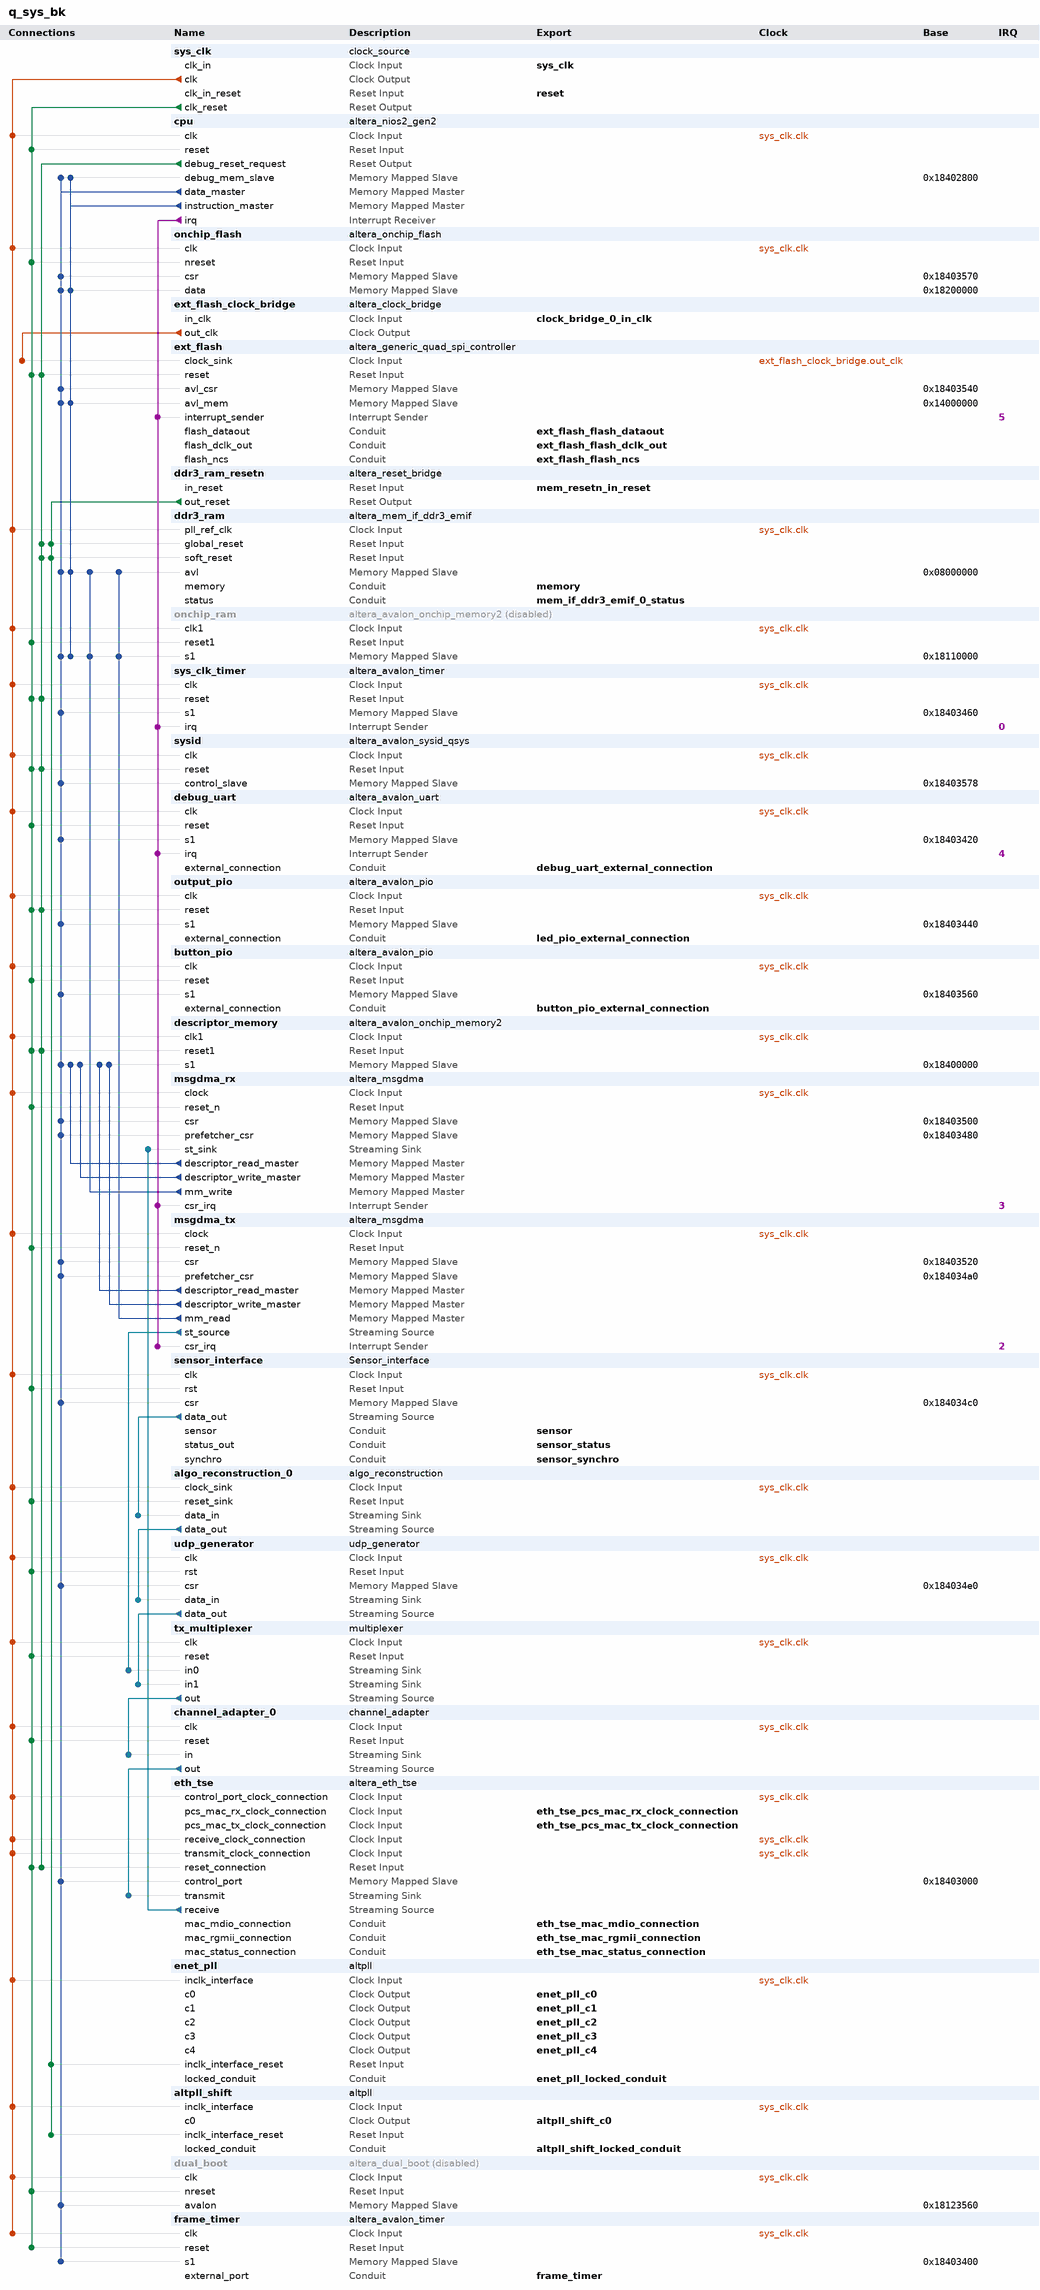
[diagram p0: system contents]
# Platform Designer (Qsys) system q_sys_bk, MAX 10 10M50DAF484C6GES
# Parameters at their usual value, and those the tool derives, are not listed.
package require -exact qsys 19.1
create_system q_sys_bk
set_project_property DEVICE_FAMILY {MAX 10}
set_project_property DEVICE 10M50DAF484C6GES

add_instance sys_clk clock_source 19.1
set_instance_parameter_value sys_clk clockFrequency 50000000

add_instance cpu altera_nios2_gen2 19.1
set_instance_parameter_value cpu dcache_size 2048
set_instance_parameter_value cpu debug_hwbreakpoint 2
set_instance_parameter_value cpu exceptionOffset 288
set_instance_parameter_value cpu exceptionSlave ddr3_ram.avl
set_instance_parameter_value cpu icache_size 2048
set_instance_parameter_value cpu impl Fast
set_instance_parameter_value cpu mul_32_impl 3
set_instance_parameter_value cpu resetSlave ext_flash.avl_mem
set_instance_parameter_value cpu setting_activateTrace true
set_instance_parameter_value cpu shift_rot_impl 0

add_instance onchip_flash altera_onchip_flash 19.1
set_instance_parameter_value onchip_flash CLOCK_FREQUENCY 50.0
set_instance_parameter_value onchip_flash CONFIGURATION_MODE {Single Uncompressed Image with Memory Initialization}
set_instance_parameter_value onchip_flash SECTOR_ACCESS_MODE {Read and write,Read and write,Read and write,Read and write,Read and write}
set_instance_parameter_value onchip_flash initFlashContent false
set_instance_parameter_value onchip_flash initializationFileName D:/projekty/HIT/v2.0/fpga/software/hit20_v3/mem_init/q_sys_onchip_flash.hex
set_instance_parameter_value onchip_flash useNonDefaultInitFile false

add_instance ext_flash_clock_bridge altera_clock_bridge 19.1
set_instance_parameter_value ext_flash_clock_bridge DERIVED_CLOCK_RATE 0
set_instance_parameter_value ext_flash_clock_bridge EXPLICIT_CLOCK_RATE 0

add_instance ext_flash altera_generic_quad_spi_controller 19.1
set_instance_parameter_value ext_flash CHIP_SELS 1
set_instance_parameter_value ext_flash FLASH_TYPE Micron512
set_instance_parameter_value ext_flash IO_MODE QUAD
set_instance_parameter_value ext_flash UNIQUE_ID {$${FILENAME}_ext_flash}
set_instance_parameter_value ext_flash clkFreq 0

add_instance ddr3_ram_resetn altera_reset_bridge 19.1
set_instance_parameter_value ddr3_ram_resetn ACTIVE_LOW_RESET 1
set_instance_parameter_value ddr3_ram_resetn SYNCHRONOUS_EDGES none

add_instance ddr3_ram altera_mem_if_ddr3_emif 19.1
set_instance_parameter_value ddr3_ram AVL_MAX_SIZE 4
set_instance_parameter_value ddr3_ram CALIBRATION_MODE Skip
set_instance_parameter_value ddr3_ram CPORT_TYPE_PORT Bidirectional,Bidirectional,Bidirectional,Bidirectional,Bidirectional,Bidirectional
set_instance_parameter_value ddr3_ram EXPORT_AFI_HALF_CLK false
set_instance_parameter_value ddr3_ram HARD_EMIF false
set_instance_parameter_value ddr3_ram MEM_BANKADDR_WIDTH 3
set_instance_parameter_value ddr3_ram MEM_CLK_FREQ 300.0
set_instance_parameter_value ddr3_ram MEM_CLK_FREQ_MAX 800.0
set_instance_parameter_value ddr3_ram MEM_COL_ADDR_WIDTH 10
set_instance_parameter_value ddr3_ram MEM_DQ_WIDTH 8
set_instance_parameter_value ddr3_ram MEM_DRV_STR RZQ/6
set_instance_parameter_value ddr3_ram MEM_FORMAT DISCRETE
set_instance_parameter_value ddr3_ram MEM_ROW_ADDR_WIDTH 14
set_instance_parameter_value ddr3_ram MEM_RTT_NOM {ODT Disabled}
set_instance_parameter_value ddr3_ram MEM_RTT_WR {Dynamic ODT off}
set_instance_parameter_value ddr3_ram MEM_TCL 5
set_instance_parameter_value ddr3_ram MEM_TFAW_NS 30.0
set_instance_parameter_value ddr3_ram MEM_TRAS_NS 35.0
set_instance_parameter_value ddr3_ram MEM_TRCD_NS 13.75
set_instance_parameter_value ddr3_ram MEM_TRFC_NS 110.0
set_instance_parameter_value ddr3_ram MEM_TRP_NS 13.75
set_instance_parameter_value ddr3_ram MEM_TRRD_NS 6.0
set_instance_parameter_value ddr3_ram MEM_TRTP_NS 7.5
set_instance_parameter_value ddr3_ram MEM_TWTR 6
set_instance_parameter_value ddr3_ram MEM_VENDOR JEDEC
set_instance_parameter_value ddr3_ram MEM_WTCL 5
set_instance_parameter_value ddr3_ram PLL_LOCATION Top_Bottom
set_instance_parameter_value ddr3_ram POWER_OF_TWO_BUS false
set_instance_parameter_value ddr3_ram PRIORITY_PORT 1,1,1,1,1,1
set_instance_parameter_value ddr3_ram RATE Half
set_instance_parameter_value ddr3_ram REF_CLK_FREQ 50.0
set_instance_parameter_value ddr3_ram SPEED_GRADE 6
set_instance_parameter_value ddr3_ram TIMING_BOARD_AC_SKEW 0.07801
set_instance_parameter_value ddr3_ram TIMING_BOARD_AC_TO_CK_SKEW -0.04709
set_instance_parameter_value ddr3_ram TIMING_BOARD_DQ_TO_DQS_SKEW -0.01152
set_instance_parameter_value ddr3_ram TIMING_BOARD_MAX_CK_DELAY 0.2443
set_instance_parameter_value ddr3_ram TIMING_BOARD_MAX_DQS_DELAY 0.21929
set_instance_parameter_value ddr3_ram TIMING_BOARD_SKEW_BETWEEN_DQS 0.04246
set_instance_parameter_value ddr3_ram TIMING_BOARD_SKEW_CKDQS_DIMM_MAX 0.04429
set_instance_parameter_value ddr3_ram TIMING_BOARD_SKEW_CKDQS_DIMM_MIN 0.02286
set_instance_parameter_value ddr3_ram TIMING_BOARD_SKEW_WITHIN_DQS 0.01806
set_instance_parameter_value ddr3_ram TIMING_TDH 45
set_instance_parameter_value ddr3_ram TIMING_TDQSCK 225
set_instance_parameter_value ddr3_ram TIMING_TDQSQ 100
set_instance_parameter_value ddr3_ram TIMING_TDQSS 0.27
set_instance_parameter_value ddr3_ram TIMING_TDS 10
set_instance_parameter_value ddr3_ram TIMING_TDSH 0.18
set_instance_parameter_value ddr3_ram TIMING_TDSS 0.18
set_instance_parameter_value ddr3_ram TIMING_TIH 120
set_instance_parameter_value ddr3_ram TIMING_TIS 170
set_instance_parameter_value ddr3_ram TIMING_TQSH 0.4
set_instance_parameter_value ddr3_ram USER_DEBUG_LEVEL 1

add_instance onchip_ram altera_avalon_onchip_memory2 19.1
set_instance_property onchip_ram ENABLED false
set_instance_parameter_value onchip_ram dataWidth 32
set_instance_parameter_value onchip_ram dualPort false
set_instance_parameter_value onchip_ram initMemContent false
set_instance_parameter_value onchip_ram initializationFileName onchip_mem.hex
set_instance_parameter_value onchip_ram memorySize 65536

add_instance sys_clk_timer altera_avalon_timer 19.1
set_instance_parameter_value sys_clk_timer period 10
set_instance_parameter_value sys_clk_timer periodUnits MSEC

add_instance sysid altera_avalon_sysid_qsys 19.1
set_instance_parameter_value sysid id -87110914

add_instance debug_uart altera_avalon_uart 19.1
set_instance_parameter_value debug_uart baud 115200
set_instance_parameter_value debug_uart dataBits 8
set_instance_parameter_value debug_uart fixedBaud true
set_instance_parameter_value debug_uart parity NONE
set_instance_parameter_value debug_uart stopBits 1

add_instance output_pio altera_avalon_pio 19.1
set_instance_parameter_value output_pio bitModifyingOutReg true
set_instance_parameter_value output_pio direction Output
set_instance_parameter_value output_pio width 8

add_instance button_pio altera_avalon_pio 19.1
set_instance_parameter_value button_pio direction Input
set_instance_parameter_value button_pio width 9

add_instance descriptor_memory altera_avalon_onchip_memory2 19.1
set_instance_parameter_value descriptor_memory dataWidth 32
set_instance_parameter_value descriptor_memory dualPort false
set_instance_parameter_value descriptor_memory initMemContent false
set_instance_parameter_value descriptor_memory initializationFileName /data/acastill/simple_socket_10M50/software/niosII_simple_socket_server/mem_init/q_sys_descriptor_memory.hex
set_instance_parameter_value descriptor_memory memorySize 8192

add_instance msgdma_rx altera_msgdma 19.1
set_instance_parameter_value msgdma_rx BURST_ENABLE 0
set_instance_parameter_value msgdma_rx DATA_FIFO_DEPTH 32
set_instance_parameter_value msgdma_rx DATA_WIDTH 32
set_instance_parameter_value msgdma_rx DESCRIPTOR_FIFO_DEPTH 8
set_instance_parameter_value msgdma_rx ENHANCED_FEATURES 0
set_instance_parameter_value msgdma_rx ERROR_ENABLE 1
set_instance_parameter_value msgdma_rx ERROR_WIDTH 6
set_instance_parameter_value msgdma_rx MAX_BURST_COUNT 2
set_instance_parameter_value msgdma_rx MAX_BYTE 2048
set_instance_parameter_value msgdma_rx MODE 2
set_instance_parameter_value msgdma_rx PACKET_ENABLE 1
set_instance_parameter_value msgdma_rx PREFETCHER_ENABLE 1
set_instance_parameter_value msgdma_rx TRANSFER_TYPE {Aligned Accesses}

add_instance msgdma_tx altera_msgdma 19.1
set_instance_parameter_value msgdma_tx BURST_ENABLE 0
set_instance_parameter_value msgdma_tx DATA_FIFO_DEPTH 32
set_instance_parameter_value msgdma_tx DATA_WIDTH 32
set_instance_parameter_value msgdma_tx DESCRIPTOR_FIFO_DEPTH 8
set_instance_parameter_value msgdma_tx ENHANCED_FEATURES 0
set_instance_parameter_value msgdma_tx ERROR_ENABLE 1
set_instance_parameter_value msgdma_tx ERROR_WIDTH 1
set_instance_parameter_value msgdma_tx MAX_BURST_COUNT 2
set_instance_parameter_value msgdma_tx MAX_BYTE 2048
set_instance_parameter_value msgdma_tx MODE 1
set_instance_parameter_value msgdma_tx PACKET_ENABLE 1
set_instance_parameter_value msgdma_tx PREFETCHER_ENABLE 1
set_instance_parameter_value msgdma_tx TRANSFER_TYPE {Aligned Accesses}

add_instance sensor_interface Sensor_interface 1.1

add_instance algo_reconstruction_0 algo_reconstruction 0

add_instance udp_generator udp_generator 1.0

add_instance tx_multiplexer multiplexer 19.1
set_instance_parameter_value tx_multiplexer bitsPerSymbol 8
set_instance_parameter_value tx_multiplexer errorWidth 1
set_instance_parameter_value tx_multiplexer numInputInterfaces 2
set_instance_parameter_value tx_multiplexer outChannelWidth 1
set_instance_parameter_value tx_multiplexer packetScheduling true
set_instance_parameter_value tx_multiplexer schedulingSize 512
set_instance_parameter_value tx_multiplexer symbolsPerBeat 4
set_instance_parameter_value tx_multiplexer useHighBitsOfChannel true
set_instance_parameter_value tx_multiplexer usePackets true

add_instance channel_adapter_0 channel_adapter 19.1
set_instance_parameter_value channel_adapter_0 inBitsPerSymbol 8
set_instance_parameter_value channel_adapter_0 inChannelWidth 1
set_instance_parameter_value channel_adapter_0 inErrorWidth 1
set_instance_parameter_value channel_adapter_0 inMaxChannel 1
set_instance_parameter_value channel_adapter_0 inReadyLatency 0
set_instance_parameter_value channel_adapter_0 inSymbolsPerBeat 4
set_instance_parameter_value channel_adapter_0 inUseEmpty false
set_instance_parameter_value channel_adapter_0 inUseEmptyPort YES
set_instance_parameter_value channel_adapter_0 inUsePackets true
set_instance_parameter_value channel_adapter_0 inUseReady true
set_instance_parameter_value channel_adapter_0 outChannelWidth 0
set_instance_parameter_value channel_adapter_0 outMaxChannel 1

add_instance eth_tse altera_eth_tse 19.1
set_instance_parameter_value eth_tse XCVR_RCFG_JTAG_ENABLE 0
set_instance_parameter_value eth_tse XCVR_SET_CAPABILITY_REG_ENABLE 0
set_instance_parameter_value eth_tse XCVR_SET_CSR_SOFT_LOGIC_ENABLE 0
set_instance_parameter_value eth_tse XCVR_SET_PRBS_SOFT_LOGIC_ENABLE 0
set_instance_parameter_value eth_tse XCVR_SET_USER_IDENTIFIER 0
set_instance_parameter_value eth_tse core_variation MAC_ONLY
set_instance_parameter_value eth_tse enable_gmii_loopback true
set_instance_parameter_value eth_tse enable_hd_logic true
set_instance_parameter_value eth_tse enable_mac_flow_ctrl false
set_instance_parameter_value eth_tse enable_magic_detect true
set_instance_parameter_value eth_tse enable_sgmii true
set_instance_parameter_value eth_tse enable_shift16 true
set_instance_parameter_value eth_tse ifGMII RGMII
set_instance_parameter_value eth_tse ing_addr 11
set_instance_parameter_value eth_tse mdio_clk_div 40
set_instance_parameter_value eth_tse nf_phyip_rcfg_enable true
set_instance_parameter_value eth_tse stat_cnt_ena true
set_instance_parameter_value eth_tse transceiver_type NONE

add_instance enet_pll altpll 19.1
set_instance_parameter_value enet_pll CLK0_DIVIDE_BY 2
set_instance_parameter_value enet_pll CLK0_MULTIPLY_BY 5
set_instance_parameter_value enet_pll CLK1_DIVIDE_BY 2
set_instance_parameter_value enet_pll CLK1_DUTY_CYCLE 50
set_instance_parameter_value enet_pll CLK1_MULTIPLY_BY 1
set_instance_parameter_value enet_pll CLK1_PHASE_SHIFT 0
set_instance_parameter_value enet_pll CLK2_DIVIDE_BY 20
set_instance_parameter_value enet_pll CLK2_DUTY_CYCLE 50
set_instance_parameter_value enet_pll CLK2_MULTIPLY_BY 1
set_instance_parameter_value enet_pll CLK2_PHASE_SHIFT 0
set_instance_parameter_value enet_pll CLK3_DIVIDE_BY 2
set_instance_parameter_value enet_pll CLK3_DUTY_CYCLE 50
set_instance_parameter_value enet_pll CLK3_MULTIPLY_BY 5
set_instance_parameter_value enet_pll CLK3_PHASE_SHIFT -3000
set_instance_parameter_value enet_pll CLK4_DIVIDE_BY 2
set_instance_parameter_value enet_pll CLK4_DUTY_CYCLE 50
set_instance_parameter_value enet_pll CLK4_MULTIPLY_BY 1
set_instance_parameter_value enet_pll CLK4_PHASE_SHIFT -10000
set_instance_parameter_value enet_pll INCLK0_INPUT_FREQUENCY 20000
set_instance_parameter_value enet_pll OPERATION_MODE NO_COMPENSATION
set_instance_parameter_value enet_pll PORT_ARESET PORT_UNUSED
set_instance_parameter_value enet_pll PORT_LOCKED PORT_USED
set_instance_parameter_value enet_pll PORT_clk1 PORT_USED
set_instance_parameter_value enet_pll PORT_clk2 PORT_USED
set_instance_parameter_value enet_pll PORT_clk3 PORT_USED
set_instance_parameter_value enet_pll PORT_clk4 PORT_USED

add_instance altpll_shift altpll 19.1
set_instance_parameter_value altpll_shift CLK0_DIVIDE_BY 1
set_instance_parameter_value altpll_shift CLK0_MULTIPLY_BY 5
set_instance_parameter_value altpll_shift CLK1_DIVIDE_BY 2
set_instance_parameter_value altpll_shift CLK1_DUTY_CYCLE 50
set_instance_parameter_value altpll_shift CLK1_MULTIPLY_BY 1
set_instance_parameter_value altpll_shift CLK1_PHASE_SHIFT 15000
set_instance_parameter_value altpll_shift CLK2_DIVIDE_BY 20
set_instance_parameter_value altpll_shift CLK2_DUTY_CYCLE 50
set_instance_parameter_value altpll_shift CLK2_MULTIPLY_BY 1
set_instance_parameter_value altpll_shift CLK2_PHASE_SHIFT 0
set_instance_parameter_value altpll_shift INCLK0_INPUT_FREQUENCY 20000
set_instance_parameter_value altpll_shift PORT_ARESET PORT_USED
set_instance_parameter_value altpll_shift PORT_LOCKED PORT_USED
set_instance_parameter_value altpll_shift PORT_clk1 PORT_UNUSED
set_instance_parameter_value altpll_shift PORT_clk2 PORT_UNUSED
set_instance_parameter_value altpll_shift PORT_clk3 PORT_UNUSED

add_instance dual_boot altera_dual_boot 19.1
set_instance_property dual_boot ENABLED false
set_instance_parameter_value dual_boot CLOCK_FREQUENCY 50.0

add_instance frame_timer altera_avalon_timer 19.1
set_instance_parameter_value frame_timer period 5000
set_instance_parameter_value frame_timer periodUnits CLOCKS
set_instance_parameter_value frame_timer snapshot false
set_instance_parameter_value frame_timer timeoutPulseOutput true

# connections
add_connection ext_flash_clock_bridge.out_clk ext_flash.clock_sink clock
add_connection sys_clk.clk algo_reconstruction_0.clock_sink clock
add_connection sys_clk.clk altpll_shift.inclk_interface clock
add_connection sys_clk.clk button_pio.clk clock
add_connection sys_clk.clk channel_adapter_0.clk clock
add_connection sys_clk.clk cpu.clk clock
add_connection sys_clk.clk ddr3_ram.pll_ref_clk clock
add_connection sys_clk.clk debug_uart.clk clock
add_connection sys_clk.clk descriptor_memory.clk1 clock
add_connection sys_clk.clk dual_boot.clk clock
add_connection sys_clk.clk enet_pll.inclk_interface clock
add_connection sys_clk.clk eth_tse.control_port_clock_connection clock
add_connection sys_clk.clk eth_tse.receive_clock_connection clock
add_connection sys_clk.clk eth_tse.transmit_clock_connection clock
add_connection sys_clk.clk frame_timer.clk clock
add_connection sys_clk.clk msgdma_rx.clock clock
add_connection sys_clk.clk msgdma_tx.clock clock
add_connection sys_clk.clk onchip_flash.clk clock
add_connection sys_clk.clk onchip_ram.clk1 clock
add_connection sys_clk.clk output_pio.clk clock
add_connection sys_clk.clk sensor_interface.clk clock
add_connection sys_clk.clk sys_clk_timer.clk clock
add_connection sys_clk.clk sysid.clk clock
add_connection sys_clk.clk tx_multiplexer.clk clock
add_connection sys_clk.clk udp_generator.clk clock
add_connection cpu.debug_reset_request ddr3_ram.global_reset reset
add_connection cpu.debug_reset_request ddr3_ram.soft_reset reset
add_connection cpu.debug_reset_request descriptor_memory.reset1 reset
add_connection cpu.debug_reset_request eth_tse.reset_connection reset
add_connection cpu.debug_reset_request ext_flash.reset reset
add_connection cpu.debug_reset_request output_pio.reset reset
add_connection cpu.debug_reset_request sys_clk_timer.reset reset
add_connection cpu.debug_reset_request sysid.reset reset
add_connection ddr3_ram_resetn.out_reset altpll_shift.inclk_interface_reset reset
add_connection ddr3_ram_resetn.out_reset ddr3_ram.global_reset reset
add_connection ddr3_ram_resetn.out_reset ddr3_ram.soft_reset reset
add_connection ddr3_ram_resetn.out_reset enet_pll.inclk_interface_reset reset
add_connection sys_clk.clk_reset algo_reconstruction_0.reset_sink reset
add_connection sys_clk.clk_reset button_pio.reset reset
add_connection sys_clk.clk_reset channel_adapter_0.reset reset
add_connection sys_clk.clk_reset cpu.reset reset
add_connection sys_clk.clk_reset debug_uart.reset reset
add_connection sys_clk.clk_reset descriptor_memory.reset1 reset
add_connection sys_clk.clk_reset dual_boot.nreset reset
add_connection sys_clk.clk_reset eth_tse.reset_connection reset
add_connection sys_clk.clk_reset ext_flash.reset reset
add_connection sys_clk.clk_reset frame_timer.reset reset
add_connection sys_clk.clk_reset msgdma_rx.reset_n reset
add_connection sys_clk.clk_reset msgdma_tx.reset_n reset
add_connection sys_clk.clk_reset onchip_flash.nreset reset
add_connection sys_clk.clk_reset onchip_ram.reset1 reset
add_connection sys_clk.clk_reset output_pio.reset reset
add_connection sys_clk.clk_reset sensor_interface.rst reset
add_connection sys_clk.clk_reset sys_clk_timer.reset reset
add_connection sys_clk.clk_reset sysid.reset reset
add_connection sys_clk.clk_reset tx_multiplexer.reset reset
add_connection sys_clk.clk_reset udp_generator.rst reset
add_connection cpu.data_master button_pio.s1 avalon
set_connection_parameter_value cpu.data_master/button_pio.s1 baseAddress 0x18403560
add_connection cpu.data_master cpu.debug_mem_slave avalon
set_connection_parameter_value cpu.data_master/cpu.debug_mem_slave baseAddress 0x18402800
add_connection cpu.data_master ddr3_ram.avl avalon
set_connection_parameter_value cpu.data_master/ddr3_ram.avl baseAddress 0x08000000
add_connection cpu.data_master debug_uart.s1 avalon
set_connection_parameter_value cpu.data_master/debug_uart.s1 baseAddress 0x18403420
add_connection cpu.data_master descriptor_memory.s1 avalon
set_connection_parameter_value cpu.data_master/descriptor_memory.s1 baseAddress 0x18400000
add_connection cpu.data_master dual_boot.avalon avalon
set_connection_parameter_value cpu.data_master/dual_boot.avalon baseAddress 0x18123560
add_connection cpu.data_master eth_tse.control_port avalon
set_connection_parameter_value cpu.data_master/eth_tse.control_port baseAddress 0x18403000
add_connection cpu.data_master ext_flash.avl_csr avalon
set_connection_parameter_value cpu.data_master/ext_flash.avl_csr baseAddress 0x18403540
add_connection cpu.data_master ext_flash.avl_mem avalon
set_connection_parameter_value cpu.data_master/ext_flash.avl_mem baseAddress 0x14000000
add_connection cpu.data_master frame_timer.s1 avalon
set_connection_parameter_value cpu.data_master/frame_timer.s1 baseAddress 0x18403400
add_connection cpu.data_master msgdma_rx.csr avalon
set_connection_parameter_value cpu.data_master/msgdma_rx.csr baseAddress 0x18403500
add_connection cpu.data_master msgdma_rx.prefetcher_csr avalon
set_connection_parameter_value cpu.data_master/msgdma_rx.prefetcher_csr baseAddress 0x18403480
add_connection cpu.data_master msgdma_tx.csr avalon
set_connection_parameter_value cpu.data_master/msgdma_tx.csr baseAddress 0x18403520
add_connection cpu.data_master msgdma_tx.prefetcher_csr avalon
set_connection_parameter_value cpu.data_master/msgdma_tx.prefetcher_csr baseAddress 0x184034a0
add_connection cpu.data_master onchip_flash.csr avalon
set_connection_parameter_value cpu.data_master/onchip_flash.csr baseAddress 0x18403570
add_connection cpu.data_master onchip_flash.data avalon
set_connection_parameter_value cpu.data_master/onchip_flash.data baseAddress 0x18200000
add_connection cpu.data_master onchip_ram.s1 avalon
set_connection_parameter_value cpu.data_master/onchip_ram.s1 baseAddress 0x18110000
add_connection cpu.data_master output_pio.s1 avalon
set_connection_parameter_value cpu.data_master/output_pio.s1 baseAddress 0x18403440
add_connection cpu.data_master sensor_interface.csr avalon
set_connection_parameter_value cpu.data_master/sensor_interface.csr baseAddress 0x184034c0
add_connection cpu.data_master sys_clk_timer.s1 avalon
set_connection_parameter_value cpu.data_master/sys_clk_timer.s1 baseAddress 0x18403460
add_connection cpu.data_master sysid.control_slave avalon
set_connection_parameter_value cpu.data_master/sysid.control_slave baseAddress 0x18403578
add_connection cpu.data_master udp_generator.csr avalon
set_connection_parameter_value cpu.data_master/udp_generator.csr baseAddress 0x184034e0
add_connection cpu.instruction_master cpu.debug_mem_slave avalon
set_connection_parameter_value cpu.instruction_master/cpu.debug_mem_slave baseAddress 0x18402800
add_connection cpu.instruction_master ddr3_ram.avl avalon
set_connection_parameter_value cpu.instruction_master/ddr3_ram.avl baseAddress 0x08000000
add_connection cpu.instruction_master ext_flash.avl_mem avalon
set_connection_parameter_value cpu.instruction_master/ext_flash.avl_mem baseAddress 0x14000000
add_connection cpu.instruction_master onchip_flash.data avalon
set_connection_parameter_value cpu.instruction_master/onchip_flash.data baseAddress 0x18200000
add_connection cpu.instruction_master onchip_ram.s1 avalon
set_connection_parameter_value cpu.instruction_master/onchip_ram.s1 baseAddress 0x18110000
add_connection msgdma_rx.descriptor_read_master descriptor_memory.s1 avalon
set_connection_parameter_value msgdma_rx.descriptor_read_master/descriptor_memory.s1 baseAddress 0x18400000
add_connection msgdma_rx.descriptor_write_master descriptor_memory.s1 avalon
set_connection_parameter_value msgdma_rx.descriptor_write_master/descriptor_memory.s1 baseAddress 0x18400000
add_connection msgdma_rx.mm_write ddr3_ram.avl avalon
set_connection_parameter_value msgdma_rx.mm_write/ddr3_ram.avl baseAddress 0x08000000
add_connection msgdma_rx.mm_write onchip_ram.s1 avalon
set_connection_parameter_value msgdma_rx.mm_write/onchip_ram.s1 baseAddress 0x18110000
add_connection msgdma_tx.descriptor_read_master descriptor_memory.s1 avalon
set_connection_parameter_value msgdma_tx.descriptor_read_master/descriptor_memory.s1 baseAddress 0x18400000
add_connection msgdma_tx.descriptor_write_master descriptor_memory.s1 avalon
set_connection_parameter_value msgdma_tx.descriptor_write_master/descriptor_memory.s1 baseAddress 0x18400000
add_connection msgdma_tx.mm_read ddr3_ram.avl avalon
set_connection_parameter_value msgdma_tx.mm_read/ddr3_ram.avl baseAddress 0x08000000
add_connection msgdma_tx.mm_read onchip_ram.s1 avalon
set_connection_parameter_value msgdma_tx.mm_read/onchip_ram.s1 baseAddress 0x18110000
add_connection algo_reconstruction_0.data_out udp_generator.data_in avalon_streaming
add_connection channel_adapter_0.out eth_tse.transmit avalon_streaming
add_connection eth_tse.receive msgdma_rx.st_sink avalon_streaming
add_connection msgdma_tx.st_source tx_multiplexer.in0 avalon_streaming
add_connection sensor_interface.data_out algo_reconstruction_0.data_in avalon_streaming
add_connection tx_multiplexer.out channel_adapter_0.in avalon_streaming
add_connection udp_generator.data_out tx_multiplexer.in1 avalon_streaming
add_connection cpu.irq debug_uart.irq interrupt
set_connection_parameter_value cpu.irq/debug_uart.irq irqNumber 4
add_connection cpu.irq ext_flash.interrupt_sender interrupt
set_connection_parameter_value cpu.irq/ext_flash.interrupt_sender irqNumber 5
add_connection cpu.irq msgdma_rx.csr_irq interrupt
set_connection_parameter_value cpu.irq/msgdma_rx.csr_irq irqNumber 3
add_connection cpu.irq msgdma_tx.csr_irq interrupt
set_connection_parameter_value cpu.irq/msgdma_tx.csr_irq irqNumber 2
add_connection cpu.irq sys_clk_timer.irq interrupt
set_connection_parameter_value cpu.irq/sys_clk_timer.irq irqNumber 0

# exported interfaces
add_interface altpll_shift_c0 clock source
set_interface_property altpll_shift_c0 EXPORT_OF altpll_shift.c0
add_interface altpll_shift_locked_conduit conduit end
set_interface_property altpll_shift_locked_conduit EXPORT_OF altpll_shift.locked_conduit
add_interface button_pio_external_connection conduit end
set_interface_property button_pio_external_connection EXPORT_OF button_pio.external_connection
add_interface clock_bridge_0_in_clk clock sink
set_interface_property clock_bridge_0_in_clk EXPORT_OF ext_flash_clock_bridge.in_clk
add_interface debug_uart_external_connection conduit end
set_interface_property debug_uart_external_connection EXPORT_OF debug_uart.external_connection
add_interface enet_pll_c0 clock source
set_interface_property enet_pll_c0 EXPORT_OF enet_pll.c0
add_interface enet_pll_c1 clock source
set_interface_property enet_pll_c1 EXPORT_OF enet_pll.c1
add_interface enet_pll_c2 clock source
set_interface_property enet_pll_c2 EXPORT_OF enet_pll.c2
add_interface enet_pll_c3 clock source
set_interface_property enet_pll_c3 EXPORT_OF enet_pll.c3
add_interface enet_pll_c4 clock source
set_interface_property enet_pll_c4 EXPORT_OF enet_pll.c4
add_interface enet_pll_locked_conduit conduit end
set_interface_property enet_pll_locked_conduit EXPORT_OF enet_pll.locked_conduit
add_interface eth_tse_mac_mdio_connection conduit end
set_interface_property eth_tse_mac_mdio_connection EXPORT_OF eth_tse.mac_mdio_connection
add_interface eth_tse_mac_rgmii_connection conduit end
set_interface_property eth_tse_mac_rgmii_connection EXPORT_OF eth_tse.mac_rgmii_connection
add_interface eth_tse_mac_status_connection conduit end
set_interface_property eth_tse_mac_status_connection EXPORT_OF eth_tse.mac_status_connection
add_interface eth_tse_pcs_mac_rx_clock_connection clock sink
set_interface_property eth_tse_pcs_mac_rx_clock_connection EXPORT_OF eth_tse.pcs_mac_rx_clock_connection
add_interface eth_tse_pcs_mac_tx_clock_connection clock sink
set_interface_property eth_tse_pcs_mac_tx_clock_connection EXPORT_OF eth_tse.pcs_mac_tx_clock_connection
add_interface ext_flash_flash_dataout conduit end
set_interface_property ext_flash_flash_dataout EXPORT_OF ext_flash.flash_dataout
add_interface ext_flash_flash_dclk_out conduit end
set_interface_property ext_flash_flash_dclk_out EXPORT_OF ext_flash.flash_dclk_out
add_interface ext_flash_flash_ncs conduit end
set_interface_property ext_flash_flash_ncs EXPORT_OF ext_flash.flash_ncs
add_interface frame_timer conduit end
set_interface_property frame_timer EXPORT_OF frame_timer.external_port
add_interface led_pio_external_connection conduit end
set_interface_property led_pio_external_connection EXPORT_OF output_pio.external_connection
add_interface mem_if_ddr3_emif_0_status conduit end
set_interface_property mem_if_ddr3_emif_0_status EXPORT_OF ddr3_ram.status
add_interface mem_resetn_in_reset reset sink
set_interface_property mem_resetn_in_reset EXPORT_OF ddr3_ram_resetn.in_reset
add_interface memory conduit end
set_interface_property memory EXPORT_OF ddr3_ram.memory
add_interface reset reset sink
set_interface_property reset EXPORT_OF sys_clk.clk_in_reset
add_interface sensor conduit end
set_interface_property sensor EXPORT_OF sensor_interface.sensor
add_interface sensor_status conduit end
set_interface_property sensor_status EXPORT_OF sensor_interface.status_out
add_interface sensor_synchro conduit end
set_interface_property sensor_synchro EXPORT_OF sensor_interface.synchro
add_interface sys_clk clock sink
set_interface_property sys_clk EXPORT_OF sys_clk.clk_in

set_interconnect_requirement {$system} qsys_mm.clockCrossingAdapter HANDSHAKE
set_interconnect_requirement {$system} qsys_mm.maxAdditionalLatency 0

save_system q_sys_bk.qsys
